# Altium project imbuelight_move_detection_ver_1.0.PrjPcb
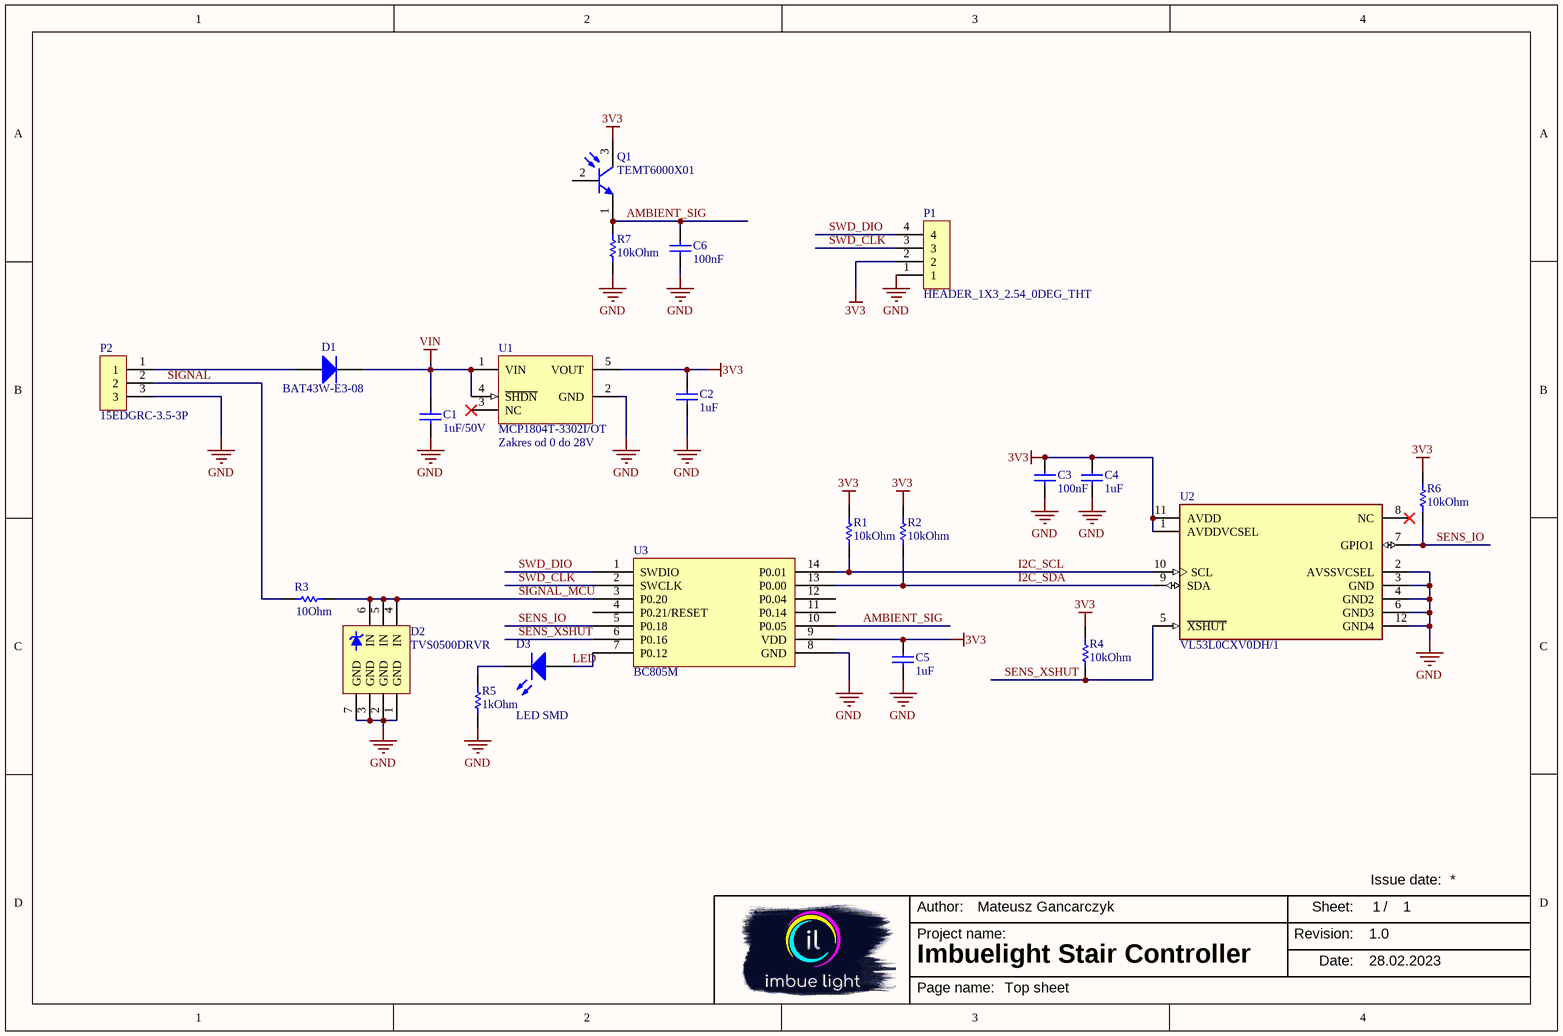
[diagram p0: imbuelight_move_detection.SchDoc]
My_Author: Mateusz Gancarczyk; My_Date: 28.02.2023; My_NameOfProject: Imbuelight Stair Controller; My_Revision: 1.0
1 sheet, 22 parts. Net scope: global (net labels, ports and power ports of the same name join across sheets).
Board files: imbuelight_move_detection.PcbDoc, imbuelight_move_detection — panel.PcbDoc

## Sheet imbuelight_move_detection.SchDoc
size A4; SheetNumber: 1; SheetTotal: 1; NameOfSheet: Top sheet

### Parts
C1  Wartość: 1uF/50V  [CAP_SMD_0805]  (hidden comment: 0805 1uF 20V)
C2  Wartość: 1uF  [CAP_SMD_0603]  (hidden comment: 0603 1uF 10V)
C3  Wartość: 100nF  [CAP_SMD_0603]  (hidden comment: 0603 1uF 10V)
C4  Wartość: 1uF  [CAP_SMD_0603]  (hidden comment: 0603 1uF 10V)
C5  Wartość: 1uF  [CAP_SMD_0603]  (hidden comment: 0603 1uF 10V)
C6  Wartość: 100nF  [CAP_SMD_0603]  (hidden comment: 0603 1uF 10V)
D1  BAT43W-E3-08  [SOD-123]
D2  TVS0500DRVR  [FP-DRV0006A-IPC_C]
D3  Wartość: LED SMD  [LED SMD 1206]  (hidden comment: Dioda LED SMD 1206)
P1  HEADER_1X3_2.54_0DEG_THT  [HDR1X4]
P2  15EDGRC-3.5-3P  [15EDGVC-3.5-03P-14-00A(H)]
Q1  TEMT6000X01  [VSIL-TEMT6000X01_V]
R1  Resistance: 10kOhm  [RES_0603]  (hidden comment: 0603 10kOhm 1%)
R2  Resistance: 10kOhm  [RES_0603]  (hidden comment: 0603 10kOhm 1%)
R3  Resistance: 10Ohm  [RES_0603]  (hidden comment: 0603 10Ohm 1%)
R4  Resistance: 10kOhm  [RES_0603]  (hidden comment: 0603 10kOhm 1%)
R5  Resistance: 1kOhm  [RES_0603]  (hidden comment: 0603 1kOhm 1%)
R6  Resistance: 10kOhm  [RES_0603]  (hidden comment: 0603 10kOhm 1%)
R7  Resistance: 10kOhm  [RES_0603]  (hidden comment: 0603 10kOhm 1%)
U1  MCP1804T-3302I/OT  [SOT-23-5]
U2  VL53L0CXV0DH/1  [FP-LGA-12-MFG]
U3  BC805M  [BC805]

### Nets
3V3: C2.2 C3.2 C4.2 C5.2 P1.2 Q1.3(C) R1.1 R2.1 R4.2 R6.1 U1.5(VOUT) U2.1(AVDDVCSEL) U2.11(AVDD) U3.9(VDD)
GND: C1.1 C2.1 C3.1 C4.1 C5.1 C6.1 D2.1(GND) D2.2(GND) D2.3(GND) D2.7(GND) P1.1 P2.3 R5.1 R7.2 U1.2(GND) U2.2(AVSSVCSEL) U2.3(GND) U2.4(GND2) U2.6(GND3) U2.12(GND4) U3.8(GND)
VIN: C1.2 D1.K U1.1(VIN) U1.4(~{SHDN})
AMBIENT_SIG: C6.2 Q1.1(E) R7.1 U3.10(P0.05)
I2C_SCL: R1.2 U2.10(SCL) U3.14(P0.01)
I2C_SDA: R2.2 U2.9(SDA) U3.13(P0.00)
LED: D3.A U3.7(P0.12)
SENS_IO: R6.2 U2.7(GPIO1) U3.5(P0.18)
SENS_XSHUT: R4.1 U2.5(~{XSHUT}) U3.6(P0.16)
SIGNAL: P2.2 R3.1
SIGNAL_MCU: D2.4(IN) D2.5(IN) D2.6(IN) R3.2 U3.3(P0.20)
SWD_CLK: P1.3 U3.2(SWCLK)
SWD_DIO: P1.4 U3.1(SWDIO)
NetD1_A: D1.A P2.1
NetD3_K: D3.K R5.2

Not connected (* = marked no-connect by the designer): Q1 2(B); U1 3(NC)*; U2 8(NC)*; U3 4(P0.21/RESET) 11(P0.14) 12(P0.04)

### Notes on the sheet
- (near U1) Zakres od 0 do 28V
- Author:
- Sheet:
- /
- Issue date:
- Project name:
- Revision:
- Date:
- Page name:

### Library data of the parts
C1-C6 = Capacitor SMD: Capacitor
D1 = Dioda SMD: Wartość: BAT43W-E3-08
D2 = TVS0500DRVR: ESD Suppressors / TVS Diodes 5V flat-clamp surge protection device 6-WSON -40 to 125; Supplier 1: Digi-Key; Supplier Part Number 1: 296-48382-1-ND
P1 = Header 1x4: 4pin 1x4 2.54mm 0.100" pitch header vertical tht; Manufacturer Part Number: HEADER_1X3_2.54_0DEG_THT
P2 = 15EDGVC-3.5-03P-14-00A(H): 15EDGVC-3.5-03P-14-00A(H) - 3 pin; Manufacturer Part Number: 15EDGRC-3.5-3P
Q1 = CMP-1666-00035-1: Ambient Light Sensor / , 100 mW, -40 to 100 degC, 3-Pin SMD, RoHS, Tape and Reel; Nominal Vf: 2 V; Luminous Intensity: 54 mcd; Forward Current: 20 mA; Viewing Angle: 130 degrees; Lens Style: Diffused; Power Rating: 75 mW; Colour: Red; Case\Package: 0603; Case Code (Imperial): 0603; Package Quantity: 3000; Packaging: Tape and Reel; Width: 0.8 mm; ComponentLink2URL: http://www.vishay.com/docs/81579/temt6000.pdf; ComponentLink1Description: Manufacturer URL; ComponentLink2Description: Datasheet; Height: 0.8 mm; Mount: Surface Mount; Pins: 2; Case Code (Metric): 1608; Max Operating Temperature: 85 degC; DatasheetVersion: Rev. 1.9, 08/2011; Forward Voltage: 2 V; ComponentLink1URL: http://www.vishay.com/; Radiation Hardening: No; RoHSCompliant: true; Length: 1.6 mm; PackageReference: 1206; Min Operating Temperature: -55 degC; PackageDescription: 3-Pin Surface Mount Device, Body 4 x 2 mm; Illumination Colour: Red
R1-R7 = Resistor SMD_1: Generic Resistor SMD; Supplier 1: LCSC
  R1 R2 R4 R6 R7: Manufacturer Part Number: 0603 10kOhm 1%; Supplier Part Number 1: C3017715
  R3: Manufacturer Part Number: 0603 10Ohm 1%; Supplier Part Number 1: C22859
  R5: Manufacturer Part Number: 0603 1kOhm 1%; Supplier Part Number 1: C3016283
U1 = MCP1804T-3302I/OT: Regulatro LDO 3,3V; Manufacturer: Microchip; DatasheetVersion: revB, Nov-2009; PackageVersion: revBB, Aug-2009; PackageReference: SOT-23-OT5; PackageDescription: 5-Lead Plastic Small Outline Transistor (OT) [SOT-23]; Supplier 1: Digi-Key; Supplier Part Number 1: MCP1804T-3302I/OTTR-ND; Supplier 2: Digi-Key; Supplier Part Number 2: MCP1804T-3302I/OTCT-ND; Supplier 3: Digi-Key; Supplier Part Number 3: MCP1804T-3302I/OTDKR-ND; Supplier 4: Farnell; Supplier Part Number 4: 1825006; Supplier 5: Newark; Supplier Part Number 5: 55R1047; Supplier 6: Newark; Supplier Part Number 6: 52R9938; Supplier 7: Mouser; Supplier Part Number 7: 579-MCP1804T-3302IOT; Mounting Technology: Surface Mount; Code_IPC: SOT23-5; PartNumber: MCP1804T-3302I/OT; ComponentLink1Description: Manufacturer URL; ComponentLink1URL: http://www.microchip.com/; ComponentLink2Description: Datasheet; ComponentLink2URL: http://ww1.microchip.com/downloads/en/DeviceDoc/22200b.pdf; ComponentLink3Description: Package Specification; ComponentLink3URL: http://www.microchip.com/stellent/groups/techpub_sg/documents/packagingspec/en012702.pdf
U2 = VL53L0CXV0DH/1: SENSOR OPTICAL 200CM I2C; Manufacturer: STMicroelectronics; Operating Supply Current: 0.016-19mA; Max Supply Voltage: 3.5V; Min Supply Voltage: 1.6V; Height: 1.05mm; Package: LGA-12; Digikey Description: SENSOR OPTICAL 200CM I2C; Device Class L1: Sensors; Device Class L2: Optical Sensors; Temperature Range High: +70°C; Sensor Output: I2C; ComponentLink2URL: https://www.st.com/resource/en/datasheet/vl53l0x.pdf; RoHS: TRUE; Temperature: -20°C to +70°C; Device Class L3: unset; Lead Free: Yes; Temperature Range Low: -20°C; Category: IC; Manufacturer Part Number: VL53L0CXV0DH/1; ComponentLink2Description: Datasheet; Octopart: https://octopart.com/vl53l0cxv0dh%2F1-stmicroelectronics-71168165; Automotive: No
U3 = BC805M: Bluetooth Low Energy (BLE) 5 Module; Supplier 1: Digi-Key; Supplier Part Number 1: 1914-BC805MCT-ND
D3 = Dioda LED SMD 1206: Typ obudowy: SMD 1206; Opis: Dioda LED